# EAGLE design RoboShield (EAGLE 9.3.1)
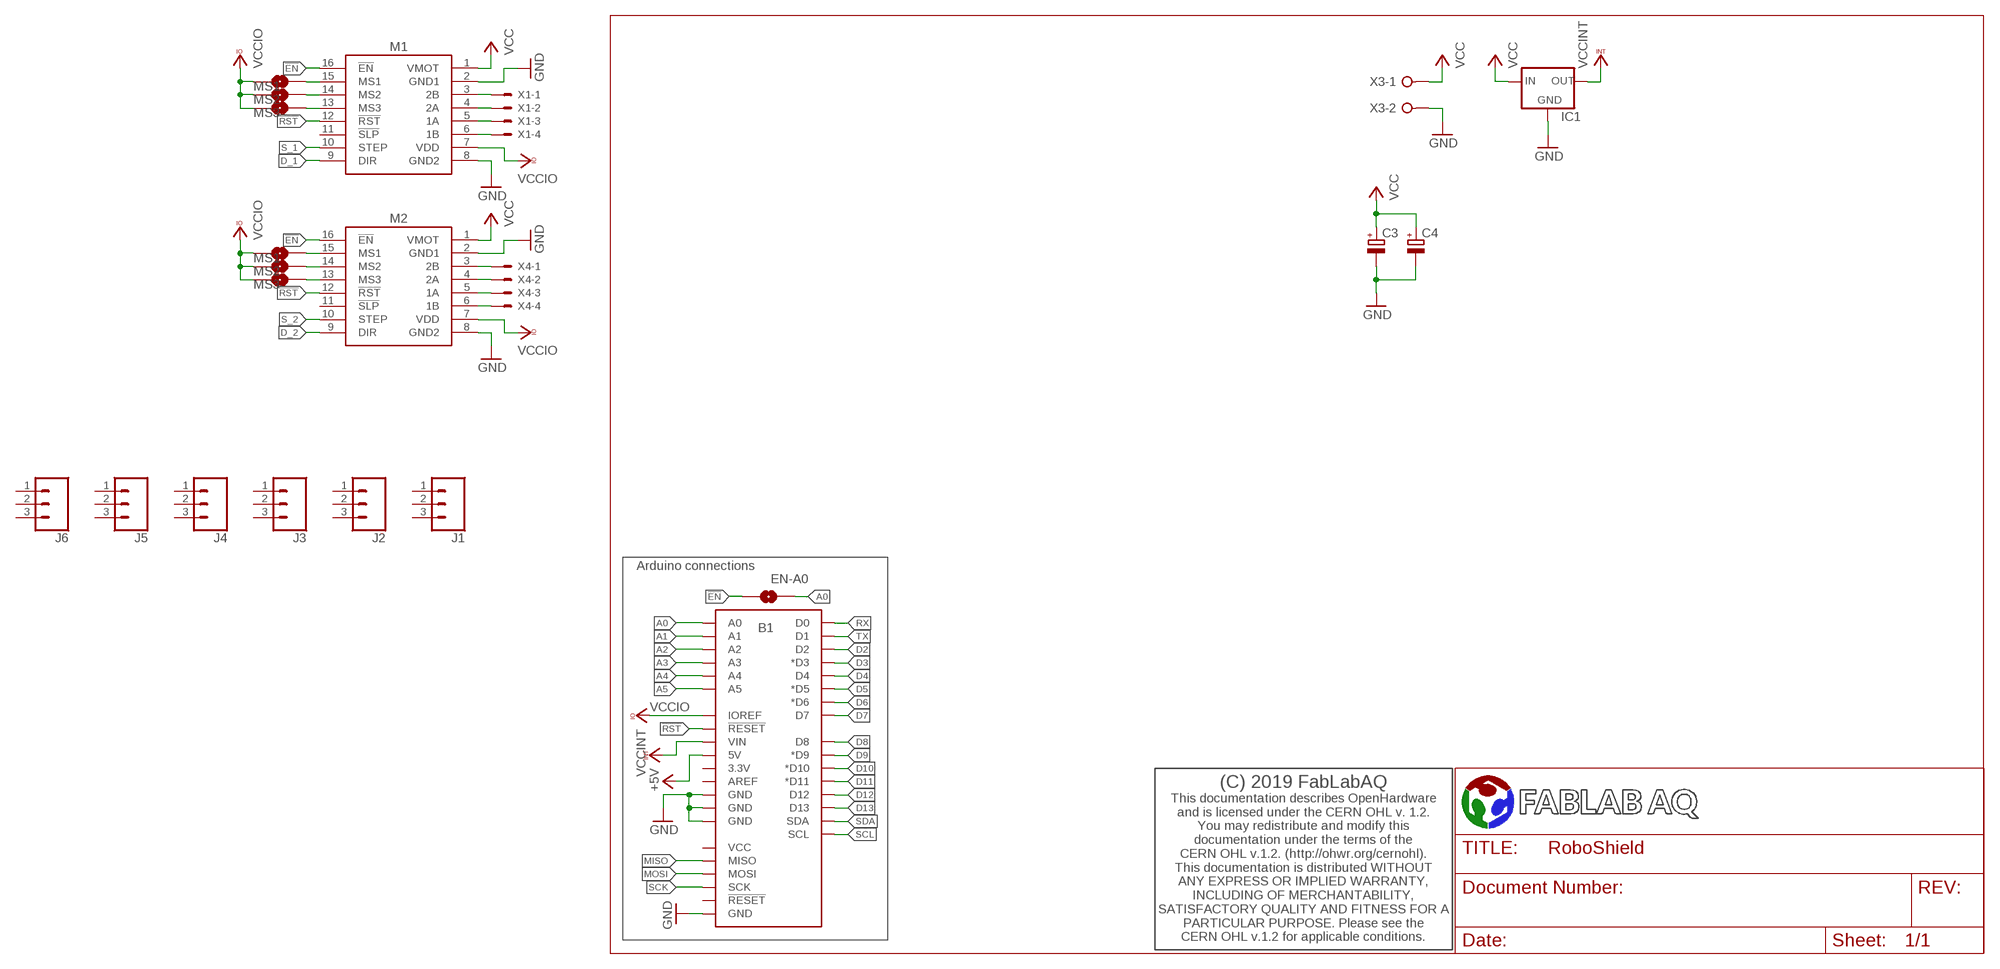
[diagram p0: schematic, sheet 1]

## Parts
B1  ARDUINO_UNO_R3NO_HOLES  [ARDUINO_R3_NO_HOLES]
C3  CPOL-EUUD-8X10  [UD-8X10_NICHICON]
C4  CPOL-EUE3.5-8  [E3,5-8]
IC1  78XXS  [78XXS]
J1  CONN_03  [1X03]
J2  CONN_03  [1X03]
J3  CONN_03  [1X03]
J4  CONN_03  [1X03]
J5  CONN_03  [1X03]
J6  CONN_03  [1X03]
JP1  MS1  JUMPER-SMT_2_NO_SILK  [SMT-JUMPER_2_NO_SILK]
JP2  MS2  JUMPER-SMT_2_NO_SILK  [SMT-JUMPER_2_NO_SILK]
JP3  MS3  JUMPER-SMT_2_NO_SILK  [SMT-JUMPER_2_NO_SILK]
JP4  EN-A0  JUMPER-SMT_2_NO_SILK  [SMT-JUMPER_2_NO_SILK]
JP5  MS1  JUMPER-SMT_2_NO_SILK  [SMT-JUMPER_2_NO_SILK]
JP6  MS2  JUMPER-SMT_2_NO_SILK  [SMT-JUMPER_2_NO_SILK]
JP7  MS3  JUMPER-SMT_2_NO_SILK  [SMT-JUMPER_2_NO_SILK]
M1  POLOLUESTEPPERDRIVER  [DIL16]
M2  POLOLUESTEPPERDRIVER  [DIL16]
U$2  (C) 2019 FabLabAQ  CERN_OHL_1.2  [DOC_CERN_OHL_1.2]
U$3  FABLABAQ_LOGOCENTER_20X40  [SILK_CENTER_20X40]
X1  JST-XH-04-PIN-LONG-PAD  [JST-XH-04-PACKAGE-LONG-PAD]
X3  W237-02P  [W237-132]
X4  JST-XH-04-PIN-LONG-PAD  [JST-XH-04-PACKAGE-LONG-PAD]

## Nets
!EN: JP4.1 M1.16(!EN) M2.16(!EN)
!RST: B1.RESET@1(!RESET!) M1.12(!RST) M2.12(!RST)
+5V: B1.5V
A0: B1.A0 JP4.2
A1: B1.A1
A2: B1.A2
A3: B1.A3
A4: B1.A4
A5: B1.A5
D2: B1.D2
D3: B1.D3(*D3)
D4: B1.D4
D5: B1.D5(*D5)
D6: B1.D6(*D6)
D7: B1.D7
D8: B1.D8
D9: B1.D9(*D9)
D10: B1.D10(*D10)
D11: B1.D11(*D11)
D12: B1.D12
D13: B1.D13
D_1: M1.9(DIR)
D_2: M2.9(DIR)
GND: B1.GND@1(GND) B1.GND@2(GND) B1.GND@3(GND) B1.GND@4(GND) C3.- C4.- IC1.GND M1.2(GND1) M1.8(GND2) M2.2(GND1) M2.8(GND2) X3.2
MISO: B1.MISO
MOSI: B1.MOSI
N$1: M1.3(2B) X1.1
N$2: M1.4(2A) X1.2
N$3: M1.5(1A) X1.3
N$4: M1.6(1B) X1.4
N$6: M2.3(2B) X4.1
N$7: M2.4(2A) X4.2
N$8: M2.5(1A) X4.3
N$9: JP2.2 M1.14(MS2)
N$10: JP3.2 M1.13(MS3)
N$11: JP1.2 M1.15(MS1)
N$12: M2.6(1B) X4.4
N$13: JP6.2 M2.14(MS2)
N$14: JP7.2 M2.13(MS3)
N$15: JP5.2 M2.15(MS1)
RX: B1.D0
S_1: M1.10(STEP)
S_2: M2.10(STEP)
SCK: B1.SCK
SCL: B1.SCL
SDA: B1.SDA
TX: B1.D1
VCC: C3.+ C4.+ IC1.IN M1.1(VMOT) M2.1(VMOT) X3.1
VCCINT: B1.VIN IC1.OUT
VCCIO: B1.IOREF JP1.1 JP2.1 JP3.1 JP5.1 JP6.1 JP7.1 M1.7(VDD) M2.7(VDD)
Unconnected: B1.3.3V B1.AREF B1.RESET@2(!RESET!) B1.VCC J1.1 J1.2 J1.3 J2.1 J2.2 J2.3 J3.1 J3.2 J3.3 J4.1 J4.2 J4.3 J5.1 J5.2 J5.3 J6.1 J6.2 J6.3 M1.11(!SLP) M2.11(!SLP)

## Notes on the sheet
- Arduino connections

## Library data of the parts
B1 = SparkFun-Boards:ARDUINO_UNO_R3: Arduino R3 Footprint with SPI header Arduino Uno R3 Compatible Footprint. Matches PCB size of the original board. SparkFun Products: SAMD21 Dev Breakout <https://www.sparkfun.com/products/13672> RedBoard <https://www.sparkfun.com/products/12757> R3 Stackable Headers <https://www.sparkfun.com/products/11417>
C3 C4 = rcl:CPOL-EU: POLARIZED CAPACITOR, European symbol; SPICEPREFIX: C
IC1 = v-reg:78XXS: VOLTAGE REGULATOR
J1-J6 = SparkFun-Connectors:CONN_03: Multi connection point. Often used as Generic Header-pin footprint for 0.1 inch spaced/style header connections On any of the 0.1 inch spaced packages, you can populate with these: Break Away Headers - Straight <https://www.sparkfun.com/products/116> (PRT-00116) Break Away Male Headers - Right Angle <https://www.sparkfun.com/products/553> (PRT-00553) Female Headers <https://www.sparkfun.com/products/115> (PRT-00115) Break Away Headers - Machine Pin <https://www.sparkfun.com/products/117> (PRT-00117) Break Away Female Headers - Swiss Machine Pin <https://www.sparkfun.com/products/743> (PRT-00743) Stackable Header - 3 Pin (Female, 0.1") <https://www.sparkfun.com/products/13875> (PRT-13875) For SCREWTERMINALS and SPRING TERMINALS visit here: Screw Terimnals on SparkFun.com <https://www.sparkfun.com/search/results?term=Screw+Terminals> (5mm/3.5mm/2.54mm spacing) This device is also useful as a general connection point to wire up your design to another part of your project. Our various solder wires solder well into these plated through hole pads. Hook-Up Wire - Assortment (Stranded, 22 AWG) <https://www.sparkfun.com/products/11375> (PRT-11375) Hook-Up Wire - Assortment (Solid Core, 22 AWG) <https://www.sparkfun.com/products/11367> (PRT-11367) View the entire wire category on our website here <https://www.sparkfun.com/categories/141> Special notes: Molex polarized connector foot print use with SKU : PRT-08232 with associated crimp pins and housings.
JP1-JP7 = SparkFun-Jumpers:JUMPER-SMT_2_NO: Normally open jumper This jumper has two pads in close proximity to each other. Apply solder to close the connection. Round pads are easier to solder for beginners, but are a lot larger. SparkFun Product that uses the round pads: SparkFun EL Sequencer <https://www.sparkfun.com/products/12781>
M1 M2 = reprap:POLOLUESTEPPERDRIVER: Pololu stepper driver based on the A4983.
U$2 = CERN_OHL_1.2:CERN_OHL_1.2
U$3 = FabLab eagle logo:FABLABAQ_LOGO
X1 X4 = Rembrandt Electronics - JST XH Connectors v1-0:JST-XH-04-PIN: JST XH Connector 2 Pin Wire to board connector. Pitch: 2,54 mm, (0.100") Number of pins: 4 Created by Rembrandt Electronics www.rembrandtelectronics.com
X3 = con-wago-508:W237-02P: WAGO SREW CLAMP; OC_FARNELL: unknown; OC_NEWARK: unknown

## Board
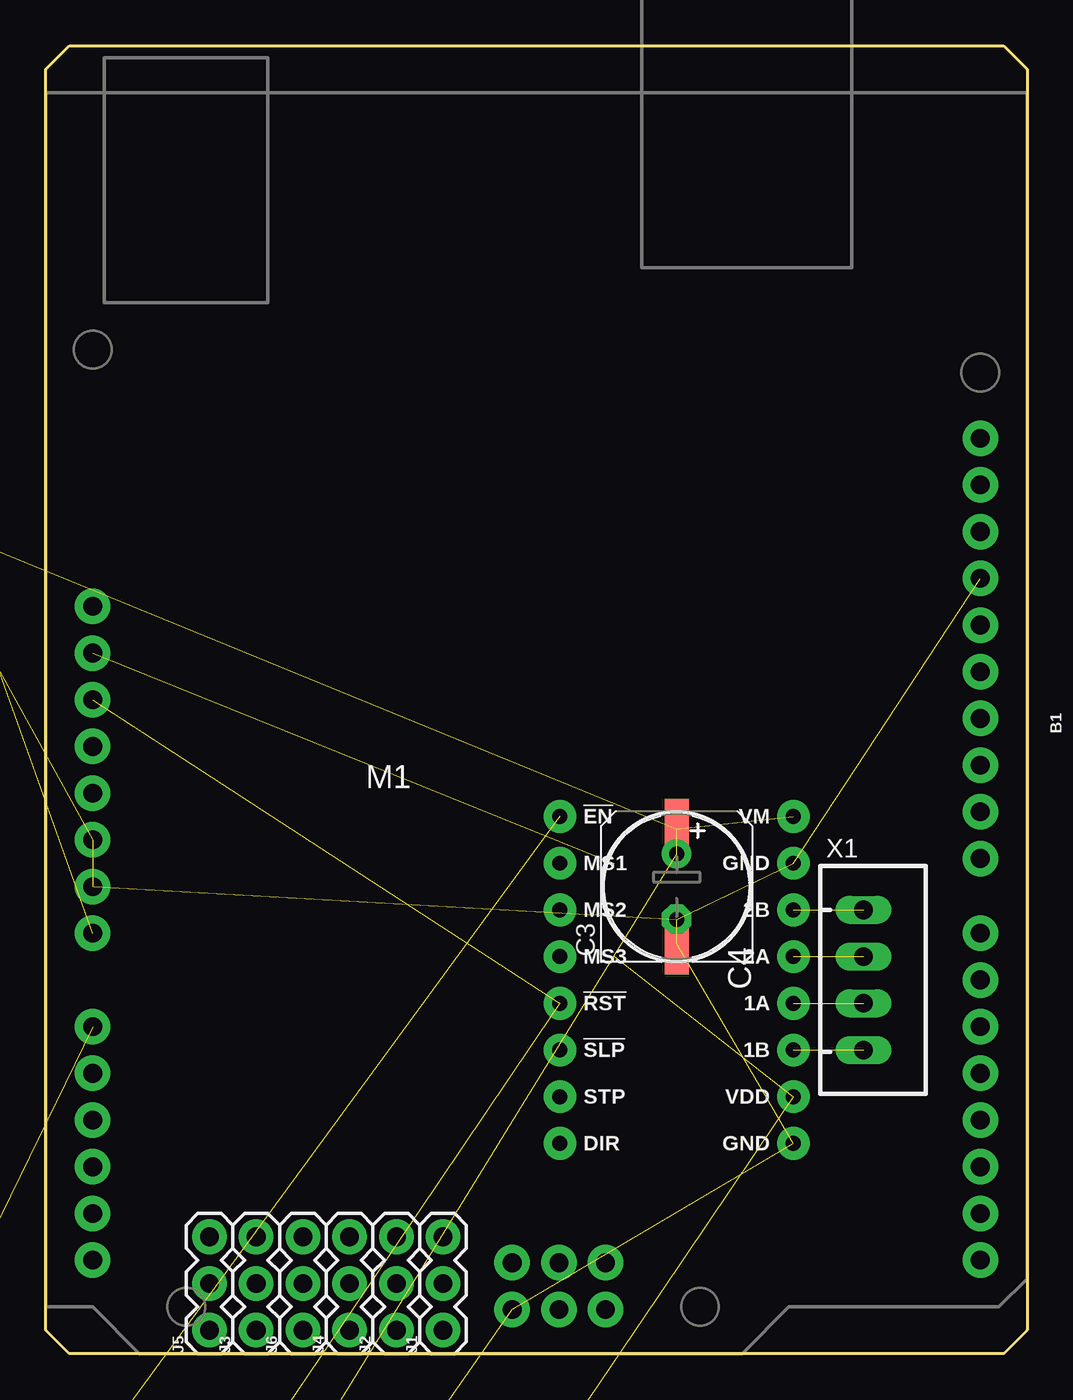
[diagram p1: board, top side]
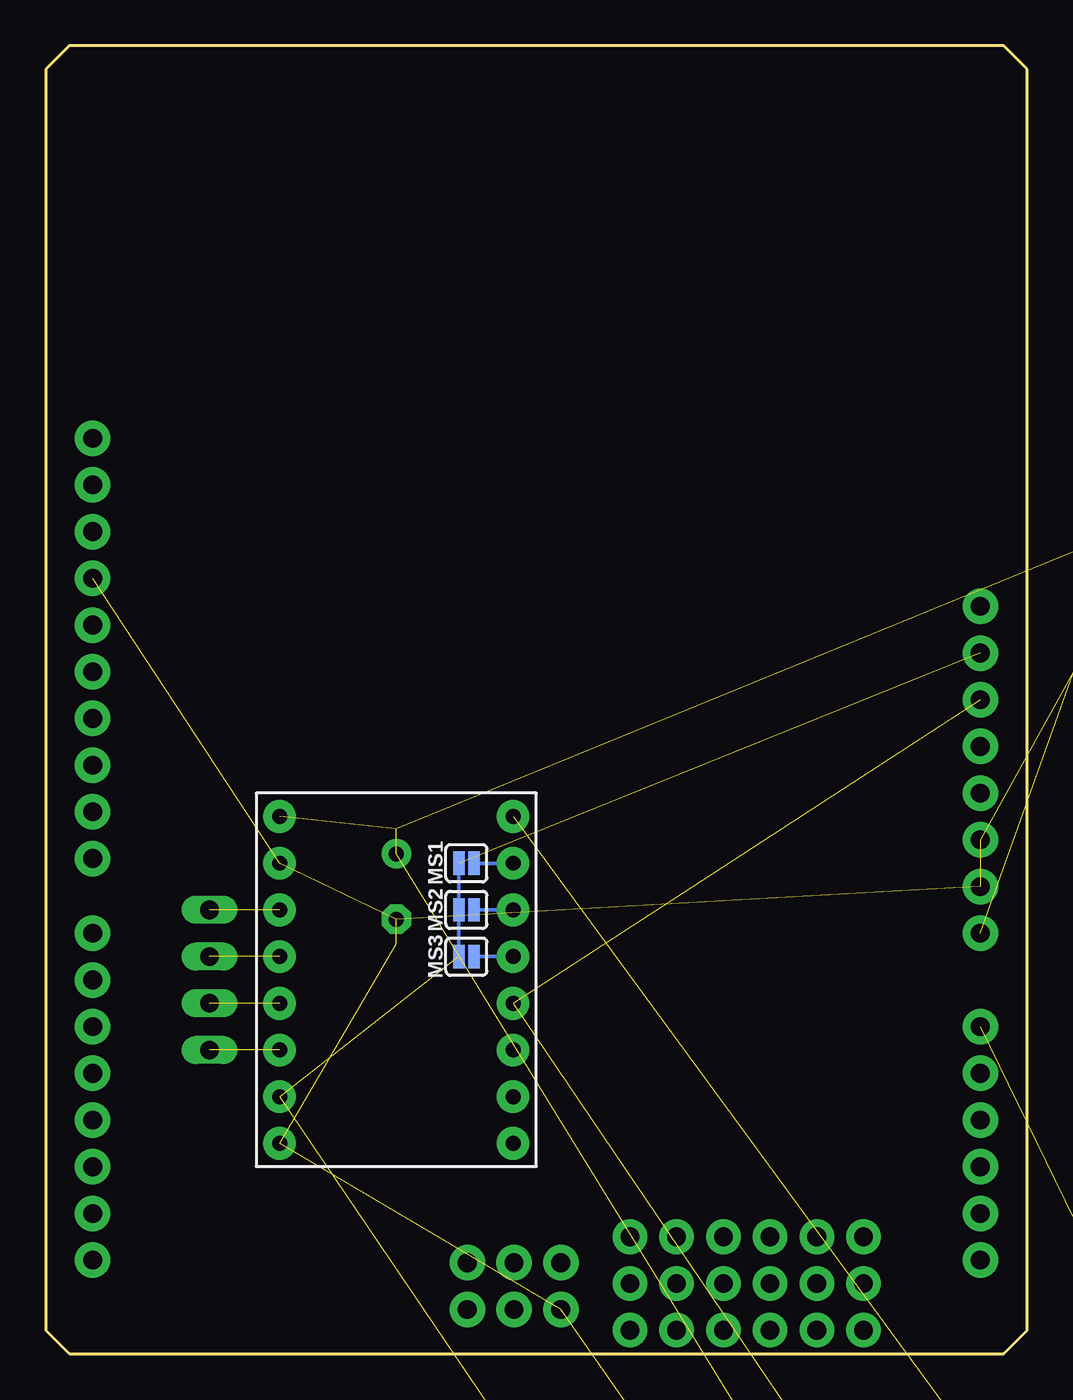
[diagram p2: board, bottom side, seen from below]

Size 53.34 x 71.12 mm. Coordinates in mm from the lower left corner, seen from the top.
Outline: 52.07,0 53.34,1.27 53.34,69.85 52.07,71.12 1.27,71.12 0,69.85 0,1.27 1.27,0 52.07,0
Copper layers (1*16): Top 0.0356mm / dielectric 1.5011mm / Bottom 0.0356mm
Design rules "PCBs_io *": minimum track width 5mil, minimum drill 0.3mm, track to track 5mil, track to pad 5mil, pad to pad 5mil, via to via 5mil, smd to smd 0mil, copper to edge 0.2mm, drill to drill 6mil, minimum pad ring 0.15mm, minimum via ring 0.15mm, stop-mask expansion 3mil, vias tented up to drill 20mil, thermal gap 10mil

### Footprints (pad centres in the part's own frame; a part is rotated, then mirrored left to right if it is on the bottom)
ARDUINO_R3_NO_HOLES = drill 1.016 pad 1.93: 3.3V 1.27,-24.13; 5V 3.81,-24.13; A0 16.51,-24.13; A1 19.05,-24.13; A2 21.59,-24.13; A3 24.13,-24.13; A4 26.67,-24.13; A5 29.21,-24.13; AREF -10.414,24.13; D0 29.21,24.13; D1 26.67,24.13; D2 24.13,24.13; D3 21.59,24.13; D4 19.05,24.13; D5 16.51,24.13; D6 13.97,24.13; D7 11.43,24.13; D8 7.366,24.13; D9 4.826,24.13; D10 2.286,24.13; D11 -0.254,24.13; D12 -2.794,24.13; D13 -5.334,24.13; GND@1 6.35,-24.13; GND@2 8.89,-24.13; GND@3 -7.874,24.13; GND@4 31.89,-1.32; IOREF -3.81,-24.13; MISO 29.35,3.76; MOSI 31.89,1.22; NC -6.35,-24.13; RESET@1 -1.27,-24.13; RESET@2 29.35,-1.32; SCK 29.35,1.22; SCL -15.494,24.13; SDA -12.954,24.13; VCC 31.89,3.76; VIN 11.43,-24.13
UD-8X10_NICHICON = smd 3.3 x 1.3: + 3.125,0; - -3.125,0
E3,5-8 = drill 0.813 pad 1.6: + -1.778,0 | drill 0.813 pad 1.6 octagon: - 1.778,0
78XXS = drill 1.016 long: GND 0,-2.54; IN -2.54,-2.54; OUT 2.54,-2.54
1X03 = drill 1.016 pad 1.88: 1 0,0; 2 2.54,0; 3 5.08,0
SMT-JUMPER_2_NO_SILK = smd 0.635 x 1.27: 1 -0.406,0; 2 0.406,0
DIL16 = drill 0.813 pad 1.778: 1 6.35,8.89; 2 6.35,6.35; 3 6.35,3.81; 4 6.35,1.27; 5 6.35,-1.27; 6 6.35,-3.81; 7 6.35,-6.35; 8 6.35,-8.89; 9 -6.35,-8.89; 10 -6.35,-6.35; 11 -6.35,-3.81; 12 -6.35,-1.27; 13 -6.35,1.27; 14 -6.35,3.81; 15 -6.35,6.35; 16 -6.35,8.89
JST-XH-04-PACKAGE-LONG-PAD = drill 1.016 long: 1 -3.81,0; 2 -1.27,0; 3 1.27,0; 4 3.81,0
W237-132 = drill 1.194 long: 1 -2.54,-0.635; 2 2.54,-0.635

### Placement (x,y rotation side)
B1  26.67,34.29 270 top
C3  34.29,25.4 90 top
C4  34.29,25.4 270 top
IC1  -12.7,60.96 0 top  (outside the outline)
J1  21.59,1.27 90 top
J2  19.05,1.27 90 top
J3  11.43,1.27 90 top
J4  16.51,1.27 90 top
J5  8.89,1.27 90 top
J6  13.97,1.27 90 top
JP1  30.48,26.67 0 bottom
JP2  30.48,24.13 0 bottom
JP3  30.48,21.59 0 bottom
JP4  -29.21,-48.26 0 bottom  (outside the outline)
JP5  -29.21,-83.82 0 bottom  (outside the outline)
JP6  -26.67,-83.82 0 top  (outside the outline)
JP7  -24.13,-83.82 0 top  (outside the outline)
M1  34.29,20.32 0 top
M2  -21.59,-62.23 0 top  (outside the outline)
U$2  1.27,-21.59 0 top  (outside the outline)
U$3  5.08,-40.64 0 top  (outside the outline)
X1  44.45,20.32 270 top
X3  -11.43,49.53 90 top  (outside the outline)
X4  -21.59,-78.74 0 top  (outside the outline)

### Tracks (layer width: path | path; a pad name or v marks a point on that pad's centre or on a via)
!EN  (2 unrouted)
!RST  (2 unrouted)
A0  (1 unrouted)
GND  (11 unrouted)
N$1  (1 unrouted)
N$2  (1 unrouted)
N$3  (1 unrouted)
N$4  (1 unrouted)
N$6  (1 unrouted)
N$7  (1 unrouted)
N$8  (1 unrouted)
N$9
  Bottom 0.203: M1.14 JP2.2
N$10
  Bottom 0.203: M1.13 JP3.2
N$11
  Bottom 0.203: M1.15 JP1.2
N$12  (1 unrouted)
N$13  (1 unrouted)
N$14  (1 unrouted)
N$15  (1 unrouted)
VCC  (5 unrouted)
VCCINT  (1 unrouted)
VCCIO  (6 unrouted)
  Bottom 0.203: JP3.1 JP2.1 JP1.1